# Altium project Ararinha_PCB.PrjPcb
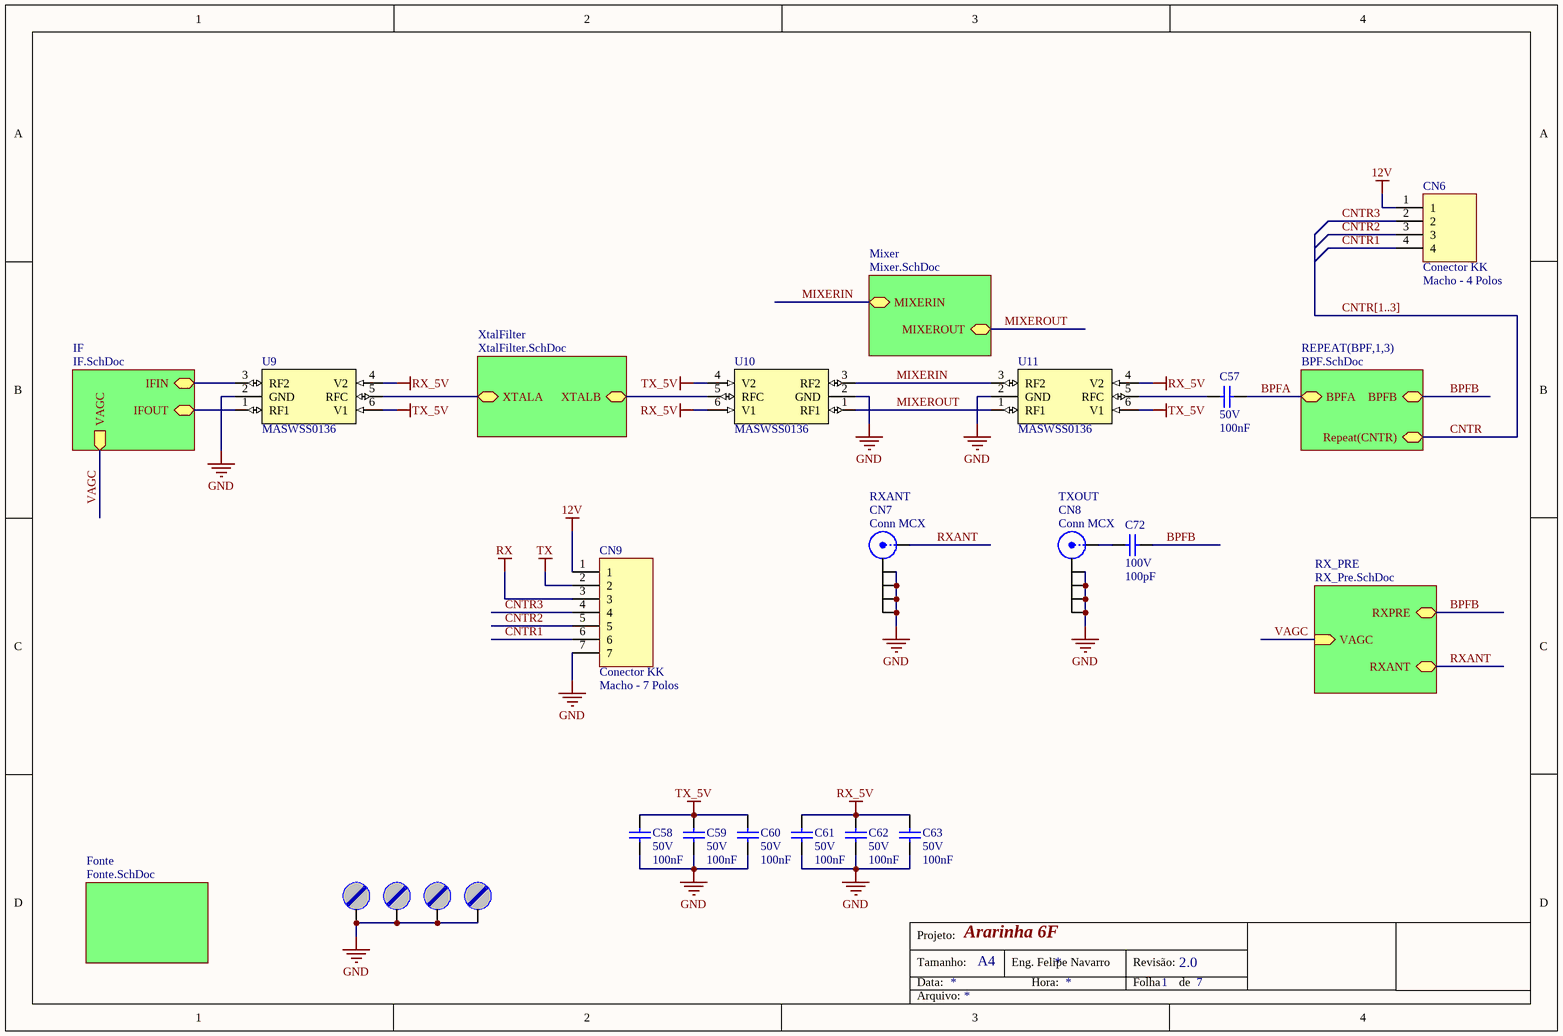
[diagram p0: Block.SchDoc]
7 sheets, 218 parts. Net scope: hierarchical (ports join the sheet entries above them; power ports are global).
Board file: Ararinha_PCB.PcbDoc
Sheets:
  Block.SchDoc
    Mixer = Mixer.SchDoc
    BPF1 = BPF.SchDoc
    BPF2 = BPF.SchDoc
    BPF3 = BPF.SchDoc
    XtalFilter = XtalFilter.SchDoc
    IF = IF.SchDoc
    RX_PRE = RX_Pre.SchDoc
    Fonte = Fonte.SchDoc

## Sheet Block.SchDoc: Ararinha 6F
size A4; Revision: 2.0; SheetNumber: 1; SheetTotal: 7

### Parts
C57  value 100nF  Tensão: 50V  [CC0603]  (hidden comment: Capacitor Cerâmico)
C58  value 100nF  Tensão: 50V  [CC0603]  (hidden comment: Capacitor Cerâmico)
C59  value 100nF  Tensão: 50V  [CC0603]  (hidden comment: Capacitor Cerâmico)
C60  value 100nF  Tensão: 50V  [CC0603]  (hidden comment: Capacitor Cerâmico)
C61  value 100nF  Tensão: 50V  [CC0603]  (hidden comment: Capacitor Cerâmico)
C62  value 100nF  Tensão: 50V  [CC0603]  (hidden comment: Capacitor Cerâmico)
C63  value 100nF  Tensão: 50V  [CC0603]  (hidden comment: Capacitor Cerâmico)
C72  value 100pF  Tensão: 100V  [CC0603]  (hidden comment: Capacitor Cerâmico)
CN6  Conector KK  value Macho - 4 Polos  [CONN HDR4-POL P.100]
CN7  Conn MCX  [CONN MCX MOLEX]
CN8  Conn MCX  [CONN MCX MOLEX]
CN9  Conector KK  value Macho - 7 Polos  [CONN HDR7-POL P.100]
HOLE1  Furo de Fixação  [Furo_M3]  (value not drawn)  (no BOM)
HOLE2  Furo de Fixação  [Furo_M3]  (value not drawn)  (no BOM)
HOLE3  Furo de Fixação  [Furo_M3]  (value not drawn)  (no BOM)
HOLE4  Furo de Fixação  [Furo_M3]  (value not drawn)  (no BOM)
U9  MASWSS0136  [SC70-6N]
U10  MASWSS0136  [SC70-6N]
U11  MASWSS0136  [SC70-6N]

### Sub-sheets
Fonte = Fonte.SchDoc: no entries
IF = IF.SchDoc: IFIN (bidir), IFOUT (bidir), VAGC (out)
Mixer = Mixer.SchDoc: MIXERIN (bidir), MIXEROUT (bidir)
REPEAT(BPF,1,3) = BPF.SchDoc: BPFA, BPFB, Repeat(CNTR)
RX_PRE = RX_Pre.SchDoc: VAGC (in), RXPRE (bidir), RXANT (bidir)
XtalFilter = XtalFilter.SchDoc: XTALB (bidir), XTALA (bidir)

### Nets
12V: CN6.1 CN9.1
GND: C58.1 C59.1 C60.1 C61.1 C62.1 C63.1 CN7.2(Y) CN7.3(Y) CN7.4(Y) CN7.5(Y) CN8.2(Y) CN8.3(Y) CN8.4(Y) CN8.5(Y) CN9.7 HOLE1.X HOLE2.X HOLE3.X HOLE4.X U9.2(GND) U10.2(GND) U11.2(GND)
RX: CN9.3
RX_5V: C61.2 C62.2 C63.2 U9.4(V2) U10.6(V1) U11.4(V2)
TX: CN9.2
TX_5V: C58.2 C59.2 C60.2 U9.6(V1) U10.4(V2) U11.6(V1)
BPFA: C57.2 ; sheet REPEAT(BPF,1,3)/BPFA
BPFB: C72.2 ; sheet REPEAT(BPF,1,3)/BPFB, sheet RX_PRE/RXPRE
CNTR: sheet REPEAT(BPF,1,3)/Repeat(CNTR)
CNTR1: CN6.4 CN9.6  [project net CNTR]
CNTR2: CN6.3 CN9.5  [project net CNTR]
CNTR3: CN6.2 CN9.4  [project net CNTR]
IFIN: U9.3(RF2) ; sheet IF/IFIN
IFOUT: U9.1(RF1) ; sheet IF/IFOUT
MIXERIN: U10.3(RF2) U11.3(RF2) ; sheet Mixer/MIXERIN
MIXEROUT: U10.1(RF1) U11.1(RF1) ; sheet Mixer/MIXEROUT
RXANT: CN7.1(X) ; sheet RX_PRE/RXANT
VAGC: sheet IF/VAGC, sheet RX_PRE/VAGC
XTALA: U9.5(RFC) ; sheet XtalFilter/XTALA
XTALB: U10.5(RFC) ; sheet XtalFilter/XTALB
NetC57_1: C57.1 U11.5(RFC)
NetC72_1: C72.1 CN8.1(X)

### Buses and harness runs
bus CNTR[1..3]

### Notes on the sheet
- (near CN7) RXANT
- TXOUT
- Projeto:
- Tamanho:
- Data:
- A4
- Eng. Felipe Navarro
- Hora:
- Revisão:
- Folha
- de
- Arquivo:

### Library data of the parts
C57-C63 = Cap 100nF 50V 0603 X7R: Capacitor (Semiconductor SIM Model); Chinês: Local; ChinesePrice: 0,00250; Corrente: *A; Potência: *W; Obs:: X7R; Tolerância: ±10%; Supplier 1: Digi-Key; Supplier Part Number 1: 1276-1000-1-ND; ComponentLink1Description: Datasheet; ComponentLink1URL: D:\Tecnoclade\Datasheet\!DataMissing.pdf
C72 = Cap 100pF 100V 0603 NP0: Capacitor (Semiconductor SIM Model); Chinês: -----; ChinesePrice: 0,00000; Corrente: *A; Potência: *W; Obs:: NP0; Tolerância: ±5%; Supplier 1: Digi-Key; Supplier Part Number 1: 1276-1295-1-ND; ComponentLink1Description: Datasheet; ComponentLink1URL: D:\Tecnoclade\Datasheet\!DataMissing.pdf
CN6 = KK 4P Macho-V P2.54mm: ChinesePrice: 0,00000; Chinês: ----; Corrente: *; Potência: *; Supplier 1: Digi-Key; Supplier Part Number 1: A19431-ND; Tensão: *; Obs:: *; Tolerância: *; ComponentLink1Description: Datasheet; ComponentLink1URL: D:\Tecnoclade\Datasheet\!DataMissing.pdf
CN7 CN8 = Conn MCX: Conector MCX; ChinesePrice: 0,00000; Chinês: ----; Value: SMA; Corrente: *; Potência: *; Supplier 1: Digi-Key; Supplier Part Number 1: WM5541-ND; Tensão: *; Obs:: *; Tolerância: *; ComponentLink1Description: Datasheet; ComponentLink1URL: D:\Tecnoclade\Datasheet\!DataMissing.pdf
CN9 = KK 7P Macho-V P2.54mm: ChinesePrice: 0,00000; Chinês: ----; Corrente: *; Potência: *; Supplier 1: Digi-Key; Supplier Part Number 1: A19472-ND; Tensão: *; Obs:: *; Tolerância: *; ComponentLink1Description: Datasheet; ComponentLink1URL: D:\Tecnoclade\Datasheet\!DataMissing.pdf
HOLE1-HOLE4 = Parafuso: Furo para parafuso; Value: M3; ChinesePrice: 0,00000; Chinês: ----; Corrente: *; Potência: *; Supplier 1: Digi-Key; Supplier Part Number 1: --Del; Tensão: *; Obs:: *; Tolerância: *; ComponentLink1Description: Datasheet; ComponentLink1URL: D:\Tecnoclade\Datasheet\!DataMissing.pdf
U9-U11 = MASWSS0136: GaAs SPDT Switch DC - 3.0 GHz; ChinesePrice: 1,94000; Chinês: Local; Value: Memória; Corrente: *; Potência: *; Supplier 1: Digi-Key; Supplier Part Number 1: 1465-1376-1-ND; Tensão: *; Obs:: *; Tolerância: *; ComponentLink1Description: Datasheet; ComponentLink1URL: D:\Tecnoclade\Datasheet\!DataMissing.pdf

## Sheet Mixer.SchDoc: Ararinha 6F
size A4; Revision: 1.0; SheetNumber: 3; SheetTotal: 7
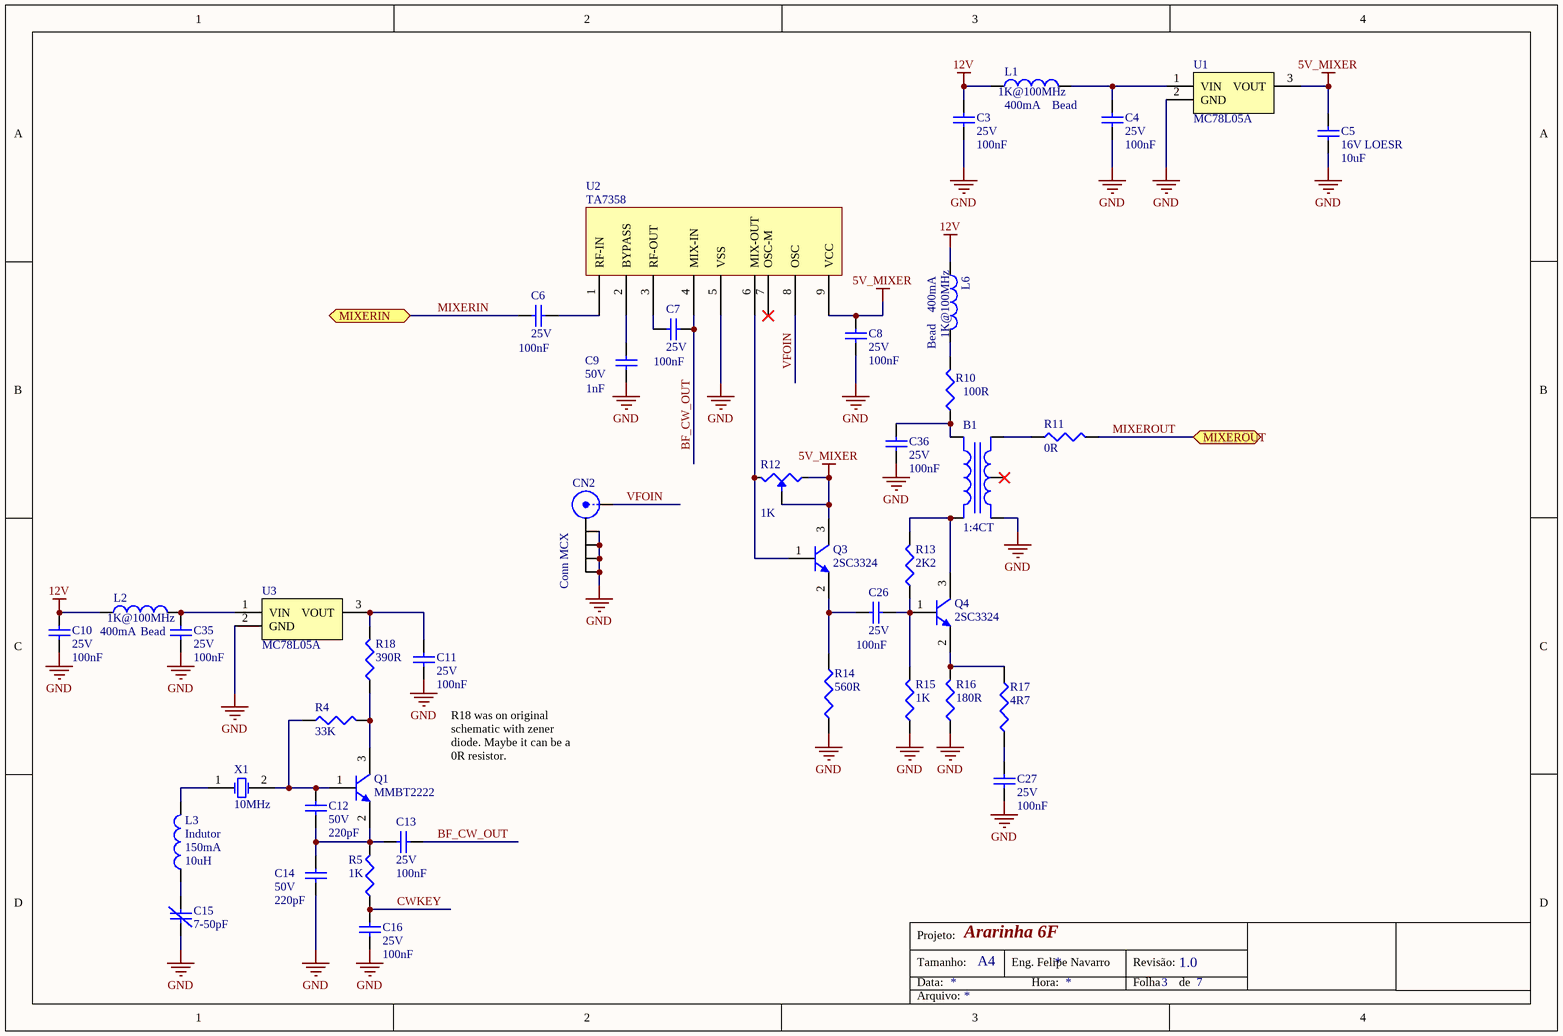
[diagram p1: Mixer.SchDoc]

### Parts
B1  1:4CT  [CX2047LANL]
C3  value 100nF  Tensão: 25V  [CC0603]  (hidden comment: Capacitor Cerâmico)
C4  value 100nF  Tensão: 25V  [CC0603]  (hidden comment: Capacitor Cerâmico)
C5  value 10uF  Tensão: 16V LOESR  [CC0805]  (hidden comment: Capacitor Cerâmico)
C6  value 100nF  Tensão: 25V  [CC0603]  (hidden comment: Capacitor Cerâmico)
C7  value 100nF  Tensão: 25V  [CC0603]  (hidden comment: Capacitor Cerâmico)
C8  value 100nF  Tensão: 25V  [CC0603]  (hidden comment: Capacitor Cerâmico)
C9  value 1nF  Tensão: 50V  [CC0603]  (hidden comment: Capacitor Cerâmico)
C10  value 100nF  Tensão: 25V  [CC0603]  (hidden comment: Capacitor Cerâmico)
C11  value 100nF  Tensão: 25V  [CC0603]  (hidden comment: Capacitor Cerâmico)
C12  value 220pF  Tensão: 50V  [CC0603]  (hidden comment: Capacitor Cerâmico)
C13  value 100nF  Tensão: 25V  [CC0603]  (hidden comment: Capacitor Cerâmico)
C14  value 220pF  Tensão: 50V  [CC0603]  (hidden comment: Capacitor Cerâmico)
C15  value 7-50pF  [MURATA TZB4]  (hidden comment: Trimmer)
C16  value 100nF  Tensão: 25V  [CC0603]  (hidden comment: Capacitor Cerâmico)
C26  value 100nF  Tensão: 25V  [CC0603]  (hidden comment: Capacitor Cerâmico)
C27  value 100nF  Tensão: 25V  [CC0603]  (hidden comment: Capacitor Cerâmico)
C35  value 100nF  Tensão: 25V  [CC0603]  (hidden comment: Capacitor Cerâmico)
C36  value 100nF  Tensão: 25V  [CC0603]  (hidden comment: Capacitor Cerâmico)
CN2  Conn MCX  [CONN MCX MOLEX]
L1  Bead  value 1K@100MHz  Corrente: 400mA  [CC0603]
L2  Bead  value 1K@100MHz  Corrente: 400mA  [CC0603]
L3  Indutor  value 10uH  Corrente: 150mA  [CC0805]
L6  Bead  value 1K@100MHz  Corrente: 400mA  [CC0603]
Q1  MMBT2222  [SOT-23-3N]
Q3  2SC3324  [SOT-23-3N]
Q4  2SC3324  [SOT-23-3N]
R4  value 33K  [CC0603]  (hidden comment: Resistor)
R5  value 1K  [CC0603]  (hidden comment: Resistor)
R10  value 100R  [CC0805]  (hidden comment: Resistor)
R11  value 0R  [CC0603~0805]  (hidden comment: Resistor)
R12  value 1K  [POT]  (hidden comment: Potenciômetro)
R13  value 2K2  [CC0603]  (hidden comment: Resistor)
R14  value 560R  [CC0603]  (hidden comment: Resistor)
R15  value 1K  [CC0603]  (hidden comment: Resistor)
R16  value 180R  [CC0603]  (hidden comment: Resistor)
R17  value 4R7  [CC0603]  (hidden comment: Resistor)
R18  value 390R  [CC0603]  (hidden comment: Resistor)
U1  MC78L05A  [SOT-89-3N]
U2  TA7358  [SIP9]
U3  MC78L05A  [SOT-89-3N]
X1  10MHz  [HC/49US]

### Ports
MIXERIN (bidir), MIXEROUT (bidir)

### Nets
5V_MIXER: C5.2 C8.1 Q3.3(C) R12.1 R12.2(TAP) U1.3(VOUT) U2.9(VCC)
12V: C3.1 C10.2 L1.1 L2.1 L6.1
GND: B1.3(Pri-) C3.2 C4.2 C5.1 C8.2 C9.2 C10.1 C11.1 C14.1 C15.1 C16.1 C27.2 C35.1 C36.2 CN2.2(Y) CN2.3(Y) CN2.4(Y) CN2.5(Y) R14.1 R15.1 R16.1 U1.2(GND) U2.5(VSS) U3.2(GND)
BF_CW_OUT: C7.1 C13.2 U2.4(MIX-IN)
CWKEY: C16.2 R5.1
MIXERIN: C6.2 ; port MIXERIN
MIXEROUT: R11.2 ; port MIXEROUT
VFOIN: CN2.1(X) U2.8(OSC)
NetB1_1: B1.1(Sec+) R11.1
NetB1_4: B1.4(Pri+) Q4.3(C) R13.2
NetB1_6: B1.6(Sec-) C36.1 R10.1
NetC4_1: C4.1 L1.2 U1.1(VIN)
NetC6_1: C6.1 U2.1(RF-IN)
NetC7_2: C7.2 U2.3(RF-OUT)
NetC9_1: C9.1 U2.2(BYPASS)
NetC11_2: C11.2 R18.2 U3.3(VOUT)
NetC12_1: C12.1 C13.1 C14.2 Q1.2(E) R5.2
NetC12_2: C12.2 Q1.1(B) R4.1 X1.2(OSC2)
NetC15_2: C15.2 L3.1
NetC26_1: C26.1 Q4.1(B) R13.1 R15.2
NetC26_2: C26.2 Q3.2(E) R14.2
NetC27_1: C27.1 R17.1
NetC35_2: C35.2 L2.2 U3.1(VIN)
NetL3_2: L3.2 X1.1(OSC1)
NetL6_2: L6.2 R10.2
NetQ1_3: Q1.3(C) R4.2 R18.1
NetQ3_1: Q3.1(B) R12.3 U2.6(MIX-OUT)
NetQ4_2: Q4.2(E) R16.2 R17.2

Not connected (* = marked no-connect by the designer): B1 2(Sec+)*; U2 7(OSC-M)*

### Notes on the sheet
- (near C11) R18 was on original schematic with zener diode. Maybe it can be a 0R resistor.
- Projeto:
- Tamanho:
- Data:
- A4
- Eng. Felipe Navarro
- Hora:
- Revisão:
- Folha
- de
- Arquivo:

### Library data of the parts
B1 = BALUN CX2047LANL: Balun 4CT:1; ChinesePrice: 0,00000; Chinês: ----; Corrente: *; Potência: *; Supplier 1: Digi-Key; Supplier Part Number 1: 553-2770-1-ND; Tensão: *; Obs:: *; Tolerância: *; ComponentLink1Description: Datasheet; ComponentLink1URL: D:\Tecnoclade\Datasheet\!DataMissing.pdf; Substituição: 00/00/0000; Value: *
C3 C4 C6-C8 C10 C11 C16 C26 C27 C35 C36 = Cap 100nF 25V 0603 X7R: Capacitor (Semiconductor SIM Model); Chinês: Local; ChinesePrice: 0,00246; Corrente: *A; Potência: *W; Obs:: X7R; Tolerância: ±10%; Supplier 1: Digi-Key; Supplier Part Number 1: 490-1524-1-ND; ComponentLink1Description: Datasheet; ComponentLink1URL: D:\Tecnoclade\Datasheet\!DataMissing.pdf
C5 = Cap 10uF 16V 0805 X6S LOESR: Capacitor (Semiconductor SIM Model); Chinês: -----; ChinesePrice: 0,00000; Corrente: *A; Potência: *W; Obs:: X6S - C2012X6S1C106K; Tolerância: ±10%; Supplier 1: Digi-Key; Supplier Part Number 1: 445-7611-1-ND; ComponentLink1Description: Datasheet; ComponentLink1URL: D:\Tecnoclade\Datasheet\!DataMissing.pdf
C9 = Cap 1nF 50V 0603 NP0: Capacitor (Semiconductor SIM Model); Chinês: Local; ChinesePrice: 0,00700; Corrente: *A; Potência: *W; Obs:: NP0; Tolerância: ±5%; Supplier 1: Digi-Key; Supplier Part Number 1: 490-1451-1-ND; ComponentLink1Description: Datasheet; ComponentLink1URL: D:\Tecnoclade\Datasheet\!DataMissing.pdf
C12 C14 = Cap 220pF 50V 0603 NP0: Capacitor (Semiconductor SIM Model); Chinês: -----; ChinesePrice: 0,00000; Corrente: *A; Potência: *W; Obs:: NP0; Tolerância: ±5%; Supplier 1: Digi-Key; Supplier Part Number 1: 1276-1048-1-ND; ComponentLink1Description: Datasheet; ComponentLink1URL: D:\Tecnoclade\Datasheet\!DataMissing.pdf
C13 = Cap 2.2pf 50V 0603 C0G: Capacitor (Semiconductor SIM Model); Chinês: ----; ChinesePrice: 0,00000; Corrente: *A; Potência: *W; Tolerância: ±*%; Supplier 1: Digi-Key; Supplier Part Number 1: 490-3091-1-ND; Obs:: *; ComponentLink1Description: Datasheet; ComponentLink1URL: D:\Tecnoclade\Datasheet\!DataMissing.pdf
C15 = Trimmer 7-50pF 50V TZB4-BB: Capacitor (Semiconductor SIM Model); Chinês: ----; ChinesePrice: 0,00000; Corrente: *A; Potência: *W; Tolerância: ±*%; Tensão: 50V; Supplier 1: Digi-Key; Supplier Part Number 1: 490-1983-1-ND; Obs:: *; ComponentLink1Description: Datasheet; ComponentLink1URL: D:\Tecnoclade\Datasheet\!DataMissing.pdf
CN2 = Conn MCX: as CN7 on sheet Block; Corrente: *; Potência: *; Supplier 1: Digi-Key; Supplier Part Number 1: WM5541-ND; Tensão: *; Obs:: *; Tolerância: *; ComponentLink1Description: Datasheet; ComponentLink1URL: D:\Tecnoclade\Datasheet\!DataMissing.pdf
L1 L2 L6 = Bd 1K@100MHz 0603 400mA: ChinesePrice: 0,00000; Chinês: -----; Obs:: Ferrite (0R5); Tolerância: ±25%; Potência: *; Supplier 1: Digi-Key; Supplier Part Number 1: 445-1550-1-ND; Tensão: *; ComponentLink1Description: Datasheet; ComponentLink1URL: D:\Tecnoclade\Datasheet\!DataMissing.pdf; Substituição: 27/06/2014
L3 = Ind 10uH 0805 150mA: Inductor; ChinesePrice: 0,00000; Chinês: ----; Tolerância: ±10%; Potência: *; Supplier 1: Digi-Key; Supplier Part Number 1: 587-2045-1-ND; Tensão: *; Obs:: *; ComponentLink1Description: Datasheet; ComponentLink1URL: D:\Tecnoclade\Datasheet\!DataMissing.pdf; Substituição: 00/00/0000
Q1 = TRS MMBT2222 40V 200mA SOT-23-3N: NPN General Purpose Amplifier; Tensão: 40V; Corrente: 200mA; Potência: 250mW; Chinês: ----; ChinesePrice: 0,00000; Value: 300MHz; Supplier 1: Digi-Key; Supplier Part Number 1: MMBT2222ATPMSCT-ND; Obs:: *; Tolerância: *; ComponentLink1Description: Datasheet; ComponentLink1URL: D:\Tecnoclade\Datasheet\!DataMissing.pdf
Q3 Q4 = TRS 2SC3324 120V 100mA SOT-23-3: NPN General Purpose Amplifier; Tensão: 40V; Corrente: 600mA; Potência: 350mW; Chinês: ----; ChinesePrice: 0,00000; Value: 300MHz; Supplier 1: Digi-Key; Supplier Part Number 1: 2SC3324-BL(TE85LFCT-ND; Obs:: *; Tolerância: *; ComponentLink1Description: Datasheet; ComponentLink1URL: D:\Tecnoclade\Datasheet\!DataMissing.pdf
R4 = Res 33K 1% 0603 1/10W: ChinesePrice: 0,00000; Chinês: ----; Corrente: *A; Potência: 1/10W; Tensão: *V; Obs: ±100ppm/ºC; Tolerância: ±1%; Supplier 1: Digi-Key; Supplier Part Number 1: RMCF0603FT33K0CT-ND; ComponentLink1Description: Datasheet; ComponentLink1URL: D:\Tecnoclade\Datasheet\!DataMissing.pdf
R5 R15 = Res 1K 1% 0603 1/10W: ChinesePrice: 0,00089; Chinês: Local; Corrente: *A; Potência: 1/10W; Tensão: *V; Tolerância: ±1%; Supplier 1: Digi-Key; Supplier Part Number 1: RMCF0603FT1K00CT-ND; Obs: *; ComponentLink1Description: Datasheet; ComponentLink1URL: D:\Tecnoclade\Datasheet\!DataMissing.pdf
R10 = Res 100R 5% 0805 1/8W: ChinesePrice: 0,00150; Chinês: Local; Corrente: *A; Potência: 1/8W; Tensão: *V; Obs: ±200ppm/ºC; Tolerância: ±5%; Supplier 1: Digi-Key; Supplier Part Number 1: RMCF0805JT100RCT-ND; ComponentLink1Description: Datasheet; ComponentLink1URL: D:\Tecnoclade\Datasheet\!DataMissing.pdf
R11 = Res 0R 0603 1/10W: ChinesePrice: 0,00089; Chinês: Local; Corrente: *A; Potência: 1/10W; Tensão: *V; Tolerância: Jumper; Supplier 1: Digi-Key; Supplier Part Number 1: P0.0GCT-ND; Obs: *; ComponentLink1Description: Datasheet; ComponentLink1URL: D:\Tecnoclade\Datasheet\!DataMissing.pdf
R12 = Res Pot: Potenciometro; ChinesePrice: 0,00000; Chinês: ----; Corrente: *A; Potência: *W; Tensão: *V; Tolerância: ±*%; Supplier 1: Digi-Key; Supplier Part Number 1: --Del; Obs: *; ComponentLink1Description: Datasheet; ComponentLink1URL: D:\Tecnoclade\Datasheet\!DataMissing.pdf
R13 = Res 2K2 5% 0603 1/10W: ChinesePrice: 0,00000; Chinês: ----; Corrente: *A; Potência: 1/10W; Tensão: *V; Obs: ±200ºC/ppm; Tolerância: ±5%; Supplier 1: Digi-Key; Supplier Part Number 1: RMCF0603JT2K20CT-ND; ComponentLink1Description: Datasheet; ComponentLink1URL: D:\Tecnoclade\Datasheet\!DataMissing.pdf
R14 = Res 560R 1% 0603 1/10w: ChinesePrice: 0,00000; Chinês: ----; Corrente: *A; Potência: 1/10W; Tensão: *V; Tolerância: ±*%; Supplier 1: Digi-Key; Supplier Part Number 1: 311-560HRCT-ND; Obs:: *; ComponentLink1Description: Datasheet; ComponentLink1URL: D:\Tecnoclade\Datasheet\!DataMissing.pdf
R16 = Res 180R 1% 0603 1/10W: ChinesePrice: 0,00000; Chinês: -----; Corrente: *A; Potência: 1/10W; Tensão: *V; Obs: ±100ppm/ºC; Tolerância: ±1%; Supplier 1: Digi-Key; Supplier Part Number 1: RMCF0603FT180RCT-ND; ComponentLink1Description: Datasheet; ComponentLink1URL: D:\Tecnoclade\Datasheet\!DataMissing.pdf
R17 = Res 4R7 1% 0603 1/10W: ChinesePrice: 0,00000; Chinês: ----; Corrente: *A; Potência: 1/10W; Tensão: *V; Tolerância: ±*%; Supplier 1: Digi-Key; Supplier Part Number 1: 311-4.7GRCT-ND; Obs:: *; ComponentLink1Description: Datasheet; ComponentLink1URL: D:\Tecnoclade\Datasheet\!DataMissing.pdf
R18 = Res 390R 1% 0603 1/10W: ChinesePrice: 0,00000; Chinês: ----; Corrente: *A; Potência: 1/10W; Tensão: *V; Obs: ±100ppm/ºC; Tolerância: ±1%; Supplier 1: Digi-Key; Supplier Part Number 1: RMCF0603FT390RCT-ND; ComponentLink1Description: Datasheet; ComponentLink1URL: D:\Tecnoclade\Datasheet\!DataMissing.pdf
U1 U3 = MC78L05: Regulador Linear 5V; Chinês: -----; Corrente: 100mA; ChinesePrice: 0,00000; Potência: *; Value: *; Supplier 1: Digi-Key; Supplier Part Number 1: MC78L05ACHXCT-ND; Tensão: 5V; Obs:: *; Tolerância: *; ComponentLink1Description: Datasheet; ComponentLink1URL: D:\Tecnoclade\Datasheet\
U2 = TA7358: FM FRONT-END; ChinesePrice: 0,00000; Chinês: ----; Corrente: *; Potência: *; Tensão: *; Value: *; Supplier 1: Digi-Key; Obs:: *; Tolerância: *; ComponentLink1Description: Datasheet; ComponentLink1URL: D:\Tecnoclade\Datasheet\
X1 = XTAL: Crystal Oscillator; ChinesePrice: 0,00000; Chinês: ----; Value: 20pF/40R; Corrente: *; Potência: *; Supplier 1: Digi-Key; Supplier Part Number 1: --Del; Tensão: *; Obs:: *; Tolerância: *

## Sheet BPF.SchDoc: Ararinha 6F
size A4; Revision: 1.0; SheetNumber: 6; SheetTotal: 7
Used 3 times, as channels BPF1, BPF2, BPF3. Parts and nets are listed once, with the designators drawn on the sheet.
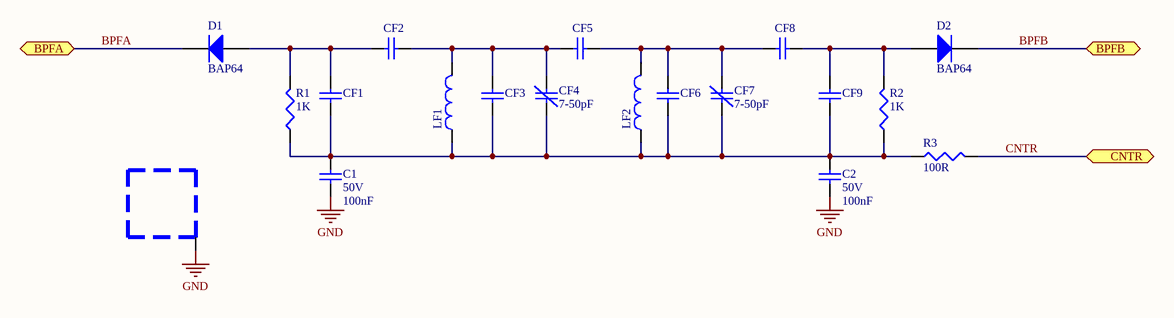
[diagram p2: BPF.SchDoc]

### Parts
BL1  Blindagem BPF  [SHIELD_26.5X26.5]  (value not drawn)
C1  value 100nF  Tensão: 50V  [CC0603]  (hidden comment: Capacitor Cerâmico)
C2  value 100nF  Tensão: 50V  [CC0603]  (hidden comment: Capacitor Cerâmico)
CF1  Capacitor Cerâmico  [CC0603]  (value not drawn)
CF2  Capacitor Cerâmico  [CC0603]  (value not drawn)
CF3  Capacitor Cerâmico  [CC0603]  (value not drawn)
CF4  value 7-50pF  [MURATA TZB4]  (hidden comment: Trimmer)
CF5  Capacitor Cerâmico  [CC0603]  (value not drawn)
CF6  Capacitor Cerâmico  [CC0603]  (value not drawn)
CF7  value 7-50pF  [MURATA TZB4]  (hidden comment: Trimmer)
CF8  Capacitor Cerâmico  [CC0603]  (value not drawn)
CF9  Capacitor Cerâmico  [CC0603]  (value not drawn)
D1  BAP64  [SOD523]
D2  BAP64  [SOD523]
LF1  Bead  [CC0603]  (value not drawn)
LF2  Bead  [CC0603]  (value not drawn)
R1  value 1K  [CC0603]  (hidden comment: Resistor)
R2  value 1K  [CC0603]  (hidden comment: Resistor)
R3  value 100R  [CC0603]  (hidden comment: Resistor)

### Ports
BPFA (bidir), BPFB (bidir), CNTR

### Nets
GND: BL1.1(GND) C1.1 C2.1
BPFA: D1.2(K) ; port BPFA
BPFB: D2.2(K) ; port BPFB
CNTR: R3.2 ; port CNTR
NetC1_2: C1.2 C2.2 CF1.1 CF3.2 CF4.1 CF6.1 CF7.1 CF9.2 LF1.1 LF2.1 R1.1 R2.1 R3.1
NetCF1_2: CF1.2 CF2.2 D1.1(A) R1.2
NetCF2_1: CF2.1 CF3.1 CF4.2 CF5.1 LF1.2
NetCF5_2: CF5.2 CF6.2 CF7.2 CF8.2 LF2.2
NetCF8_1: CF8.1 CF9.1 D2.1(A) R2.2

### Channels
BPF1: designators end in .1; ports BPFA=BPFA BPFB=BPFB CNTR=CNTR
BPF2: designators end in .2; ports BPFA=BPFA BPFB=BPFB CNTR=CNTR
BPF3: designators end in .3; ports BPFA=BPFA BPFB=BPFB CNTR=CNTR

### Notes on the sheet
- Projeto:
- Tamanho:
- Data:
- A4
- Eng. Felipe Navarro
- Hora:
- Revisão:
- Folha
- de
- Arquivo:

### Library data of the parts
BL1 = Blindagem BPF: ChinesePrice: 0,00000; Chinês: ----; Corrente: *; Potência: *; Supplier 1: Digi-Key; Supplier Part Number 1: --Del; Tensão: *; Value: *; Obs:: *; Tolerância: *; ComponentLink1Description: Datasheet; ComponentLink1URL: D:\Tecnoclade\Datasheet\
C1 C2 = Cap 100nF 50V 0603 X7R: as C57 on sheet Block; Supplier 1: Digi-Key; Supplier Part Number 1: 1276-1000-1-ND; ComponentLink1Description: Datasheet; ComponentLink1URL: D:\Tecnoclade\Datasheet\!DataMissing.pdf
CF1-CF3 CF5 CF6 CF8 CF9 = Cap - $Val $V $Footprint $Classe_1: Capacitor (Semiconductor SIM Model); Chinês: ----; ChinesePrice: 0,00000; Corrente: *A; Potência: *W; Tolerância: ±*%; Tensão: 25V; Value: 100nF; Supplier 1: Digi-Key; Supplier Part Number 1: --Del; Obs:: *; ComponentLink1Description: Datasheet; ComponentLink1URL: D:\Tecnoclade\Datasheet\!DataMissing.pdf
CF4 CF7 = Trimmer 7-50pF 50V TZB4-BB: as C15 on sheet Mixer; Supplier 1: Digi-Key; Supplier Part Number 1: 490-1983-1-ND; Obs:: *; ComponentLink1Description: Datasheet; ComponentLink1URL: D:\Tecnoclade\Datasheet\!DataMissing.pdf
D1 D2 = PIN BAP64: PIN DIODE; ChinesePrice: 0,00000; Chinês: ----; Corrente: *; Potência: *; Supplier 1: Digi-Key; Supplier Part Number 1: 568-1929-1-ND; Tensão: *; Value: *; Obs:: *; Tolerância: *; ComponentLink1Description: Datasheet; ComponentLink1URL: D:\Tecnoclade\Datasheet\!DataMissing.pdf
LF1 LF2 = Bd 1K@100MHz 0603 400mA: ChinesePrice: 0,00000; Chinês: -----; Obs:: Ferrite (0R5); Tolerância: ±25%; Corrente: 400mA; Potência: *; Supplier 1: Digi-Key; Supplier Part Number 1: 445-1550-1-ND; Tensão: *; ComponentLink1Description: Datasheet; ComponentLink1URL: D:\Tecnoclade\Datasheet\!DataMissing.pdf; Substituição: 27/06/2014; Value: 1K@100MHz
R1 R2 = Res 1K 1% 0603 1/10W: as R5 on sheet Mixer; Supplier 1: Digi-Key; Supplier Part Number 1: RMCF0603FT1K00CT-ND; Obs: *; ComponentLink1Description: Datasheet; ComponentLink1URL: D:\Tecnoclade\Datasheet\!DataMissing.pdf
R3 = Res 100R 5% 0603 1/10W: ChinesePrice: 0,00080; Chinês: Local; Corrente: *A; Potência: 1/10W; Tensão: *V; Tolerância: ±5%; Supplier 1: Digi-Key; Supplier Part Number 1: RMCF0603JT100RCT-ND; Obs: *; ComponentLink1Description: Datasheet; ComponentLink1URL: D:\Tecnoclade\Datasheet\!DataMissing.pdf

## Sheet XtalFilter.SchDoc: Ararinha 6F
size A4; Revision: 1.0; SheetNumber: 5; SheetTotal: 7
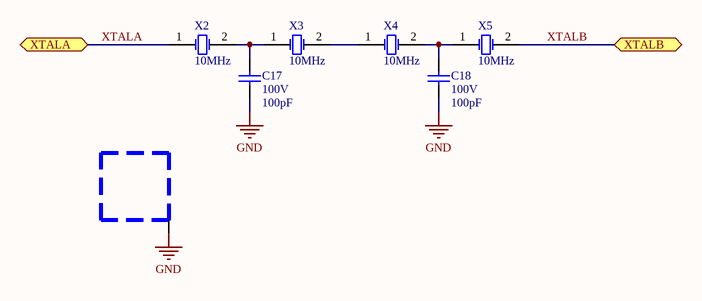
[diagram p3: XtalFilter.SchDoc]

### Parts
BL2  Blindagem BPF  [SHIELD_26.5X26.5]  (value not drawn)
C17  value 100pF  Tensão: 100V  [CC0603]  (hidden comment: Capacitor Cerâmico)
C18  value 100pF  Tensão: 100V  [CC0603]  (hidden comment: Capacitor Cerâmico)
X2  10MHz  [HC/49US]
X3  10MHz  [HC/49US]
X4  10MHz  [HC/49US]
X5  10MHz  [HC/49US]

### Ports
XTALA, XTALB (bidir)

### Nets
GND: BL2.1(GND) C17.1 C18.1
XTALA: X2.1(OSC1) ; port XTALA
XTALB: X5.2(OSC2) ; port XTALB
NetC17_2: C17.2 X2.2(OSC2) X3.1(OSC1)
NetC18_2: C18.2 X4.2(OSC2) X5.1(OSC1)
NetX3_2: X3.2(OSC2) X4.1(OSC1)

### Notes on the sheet
- Projeto:
- Tamanho:
- Data:
- A4
- Eng. Felipe Navarro
- Hora:
- Revisão:
- Folha
- de
- Arquivo:

### Library data of the parts
BL2 = Blindagem BPF: ChinesePrice: 0,00000; Chinês: ----; Corrente: *; Potência: *; Supplier 1: Digi-Key; Supplier Part Number 1: --Del; Tensão: *; Value: *; Obs:: *; Tolerância: *; ComponentLink1Description: Datasheet; ComponentLink1URL: D:\Tecnoclade\Datasheet\
C17 C18 = Cap 100pF 100V 0603 NP0: as C72 on sheet Block; Supplier 1: Digi-Key; Supplier Part Number 1: 1276-1295-1-ND; ComponentLink1Description: Datasheet; ComponentLink1URL: D:\Tecnoclade\Datasheet\!DataMissing.pdf
X2-X5 = XTAL: as X1 on sheet Mixer; Corrente: *; Potência: *; Supplier 1: Digi-Key; Supplier Part Number 1: ECS-100-18-5PX-TR; Tensão: *; Obs:: *; Tolerância: *

## Sheet IF.SchDoc: Ararinha 6F
size A4; Revision: 1.0; SheetNumber: 2; SheetTotal: 7
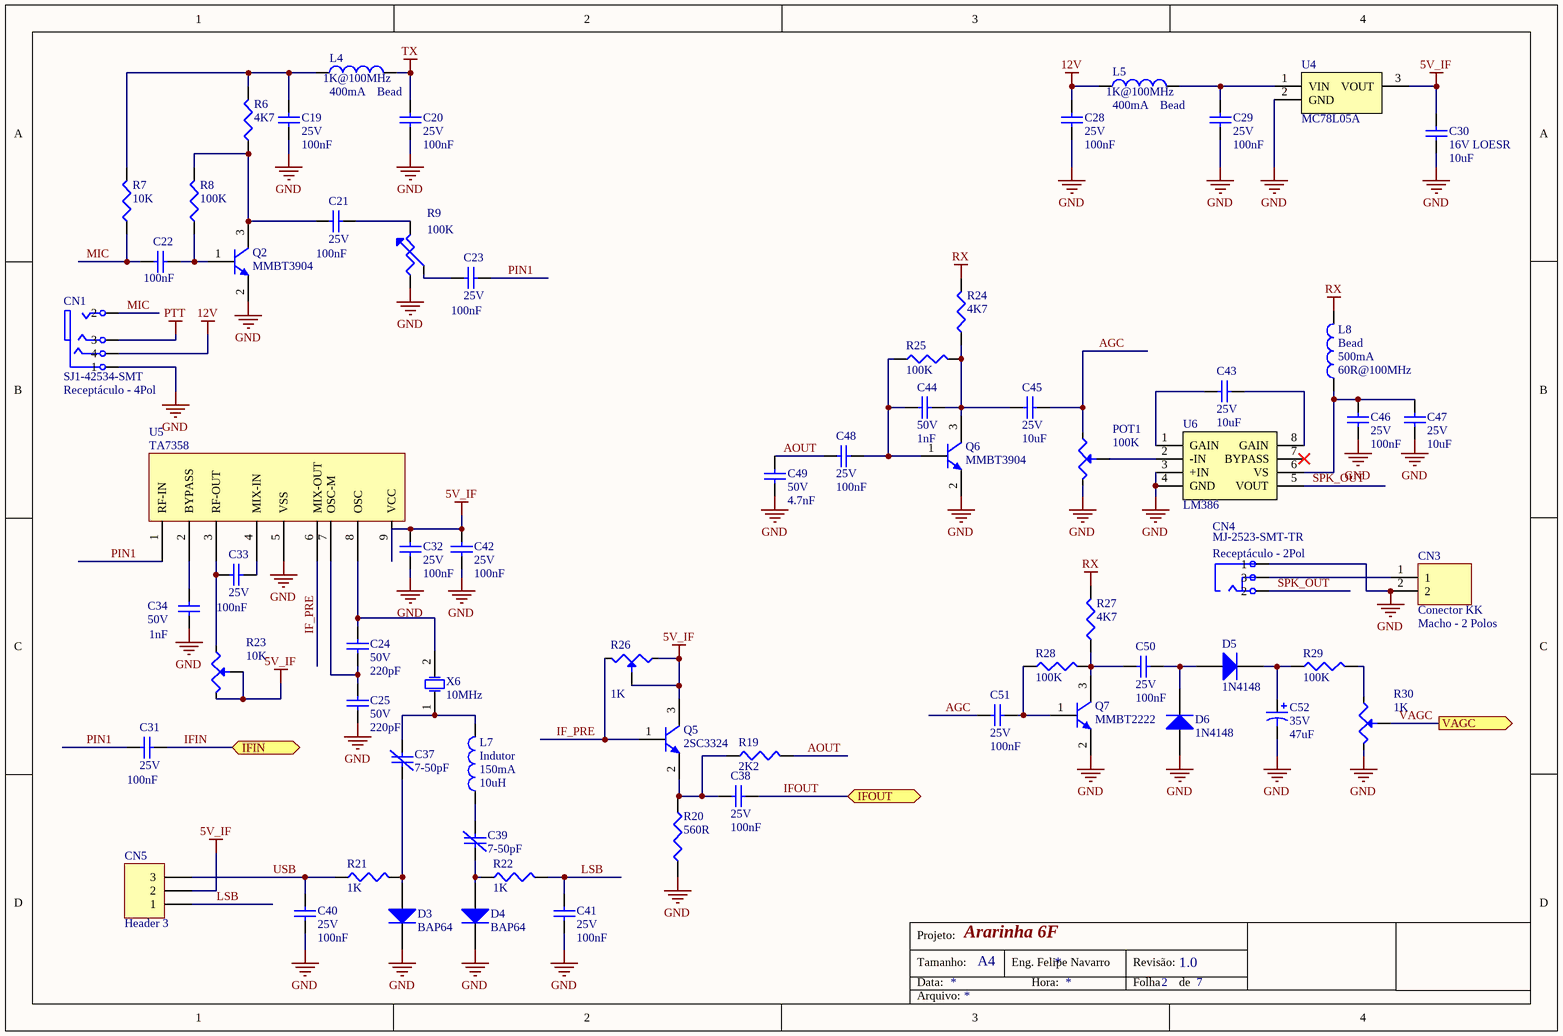
[diagram p4: IF.SchDoc]

### Parts
C19  value 100nF  Tensão: 25V  [CC0603]  (hidden comment: Capacitor Cerâmico)
C20  value 100nF  Tensão: 25V  [CC0603]  (hidden comment: Capacitor Cerâmico)
C21  value 100nF  Tensão: 25V  [CC0603]  (hidden comment: Capacitor Cerâmico)
C22  value 100nF  [CC0603]  (hidden comment: Capacitor Cerâmico)
C23  value 100nF  Tensão: 25V  [CC0603]  (hidden comment: Capacitor Cerâmico)
C24  value 220pF  Tensão: 50V  [CC0603]  (hidden comment: Capacitor Cerâmico)
C25  value 220pF  Tensão: 50V  [CC0603]  (hidden comment: Capacitor Cerâmico)
C28  value 100nF  Tensão: 25V  [CC0603]  (hidden comment: Capacitor Cerâmico)
C29  value 100nF  Tensão: 25V  [CC0603]  (hidden comment: Capacitor Cerâmico)
C30  value 10uF  Tensão: 16V LOESR  [CC0805]  (hidden comment: Capacitor Cerâmico)
C31  value 100nF  Tensão: 25V  [CC0603]  (hidden comment: Capacitor Cerâmico)
C32  value 100nF  Tensão: 25V  [CC0603]  (hidden comment: Capacitor Cerâmico)
C33  value 100nF  Tensão: 25V  [CC0603]  (hidden comment: Capacitor Cerâmico)
C34  value 1nF  Tensão: 50V  [CC0603]  (hidden comment: Capacitor Cerâmico)
C37  value 7-50pF  [MURATA TZB4]  (hidden comment: Trimmer)
C38  value 100nF  Tensão: 25V  [CC0603]  (hidden comment: Capacitor Cerâmico)
C39  value 7-50pF  [MURATA TZB4]  (hidden comment: Trimmer)
C40  value 100nF  Tensão: 25V  [CC0603]  (hidden comment: Capacitor Cerâmico)
C41  value 100nF  Tensão: 25V  [CC0603]  (hidden comment: Capacitor Cerâmico)
C42  value 100nF  Tensão: 25V  [CC0603]  (hidden comment: Capacitor Cerâmico)
C43  value 10uF  Tensão: 25V  [CC0805]  (hidden comment: Capacitor Cerâmico)
C44  value 1nF  Tensão: 50V  [CC0603]  (hidden comment: Capacitor Cerâmico)
C45  value 10uF  Tensão: 25V  [CC0805]  (hidden comment: Capacitor Cerâmico)
C46  value 100nF  Tensão: 25V  [CC0603]  (hidden comment: Capacitor Cerâmico)
C47  value 10uF  Tensão: 25V  [CC0805]  (hidden comment: Capacitor Cerâmico)
C48  value 100nF  Tensão: 25V  [CC0603]  (hidden comment: Capacitor Cerâmico)
C49  value 4.7nF  Tensão: 50V  [CC0603]  (hidden comment: Capacitor Cerâmico)
C50  value 100nF  Tensão: 25V  [CC0603]  (hidden comment: Capacitor Cerâmico)
C51  value 100nF  Tensão: 25V  [CC0603]  (hidden comment: Capacitor Cerâmico)
C52  value 47uF  Tensão: 35V  [CPOLRAD5X11]  (hidden comment: Capacitor Eletrolítico)
CN1  SJ1-42534-SMT  value Receptáculo - 4Pol  [CONN_JACK-P2_2.5-4N]
CN3  Conector KK  value Macho - 2 Polos  [CONN HDR2-POL P.100]
CN4  MJ-2523-SMT-TR  value Receptáculo - 2Pol  [MJ-2523-SMT-TR]
CN5  Header 3  [CONN HDR1X3]
D3  BAP64  [SOD523]
D4  BAP64  [SOD523]
D5  1N4148  [SOD-323 Diodo-K2]
D6  1N4148  [SOD-323 Diodo-K2]
L4  Bead  value 1K@100MHz  Corrente: 400mA  [CC0603]
L5  Bead  value 1K@100MHz  Corrente: 400mA  [CC0603]
L7  Indutor  value 10uH  Corrente: 150mA  [CC0805]
L8  Bead  value 60R@100MHz  Corrente: 500mA  [CC0603]
POT1  value 100K  [POT - PTV09]  (hidden comment: Potenciômetro)
Q2  MMBT3904  [SOT-23-3N]
Q5  2SC3324  [SOT-23-3N]
Q6  MMBT3904  [SOT-23-3N]
Q7  MMBT2222  [SOT-23-3N]
R6  value 4K7  [CC0603]  (hidden comment: Resistor)
R7  value 10K  [CC0603]  (hidden comment: Resistor)
R8  value 100K  [CC0603]  (hidden comment: Resistor)
R9  value 100K  [POT]  (hidden comment: Potenciômetro)
R19  value 2K2  [CC0603]  (hidden comment: Resistor)
R20  value 560R  [CC0603]  (hidden comment: Resistor)
R21  value 1K  [CC0603]  (hidden comment: Resistor)
R22  value 1K  [CC0603]  (hidden comment: Resistor)
R23  value 10K  [POT]  (hidden comment: Potenciômetro)
R24  value 4K7  [CC0603]  (hidden comment: Resistor)
R25  value 100K  [CC0603]  (hidden comment: Resistor)
R26  value 1K  [POT]  (hidden comment: Potenciômetro)
R27  value 4K7  [CC0603]  (hidden comment: Resistor)
R28  value 100K  [CC0603]  (hidden comment: Resistor)
R29  value 100K  [CC0603]  (hidden comment: Resistor)
R30  value 1K  [POT]  (hidden comment: Potenciômetro)
U4  MC78L05A  [SOT-89-3N]
U5  TA7358  [SIP9]
U6  LM386  [SOIC-8N]
X6  10MHz  [HC/49US]

### Ports
IFIN (bidir), IFOUT (bidir), VAGC (out)

### Nets
5V_IF: C30.2 C32.1 C42.1 CN5.2 Q5.3(C) R23.2(TAP) R23.3 R26.1 R26.2(TAP) U4.3(VOUT) U5.9(VCC)
12V: C28.1 CN1.4 L5.1
GND: C19.2 C20.2 C25.1 C28.2 C29.2 C30.1 C32.2 C34.2 C40.2 C41.2 C42.2 C46.2 C47.1 C49.1 C52.2 CN1.1 CN3.2 CN4.1 D3.2(K) D4.2(K) D6.1(A) POT1.3 Q2.2(E) Q6.2(E) Q7.2(E) R9.2 R20.1 R30.3 U4.2(GND) U5.5(VSS) U6.3(+IN) U6.4(GND)
PTT: CN1.3
RX: L8.2 R24.2 R27.2
TX: C20.1 L4.2
AGC: C45.2 C51.1 POT1.1
AOUT: C48.1 C49.2 R19.2
IF_PRE: Q5.1(B) R26.3 U5.6(MIX-OUT)
IFIN: C31.1 ; port IFIN
IFOUT: C38.2 ; port IFOUT
LSB: C41.1 CN5.1 R22.2
MIC: C22.2 CN1.2 R7.1
PIN1: C23.1 C31.2 U5.1(RF-IN)
SPK_OUT: CN4.2 U6.5(VOUT)
USB: C40.1 CN5.3 R21.1
VAGC: R30.2(TAP) ; port VAGC
NetC19_1: C19.1 L4.1 R6.2 R7.2
NetC21_1: C21.1 R9.1
NetC21_2: C21.2 Q2.3(C) R6.1 R8.2
NetC22_1: C22.1 Q2.1(B) R8.1
NetC23_2: C23.2 R9.3(TAP)
NetC24_1: C24.1 C25.2 U5.7(OSC-M)
NetC24_2: C24.2 U5.8(OSC) X6.2(OSC2)
NetC29_1: C29.1 L5.2 U4.1(VIN)
NetC33_1: C33.1 U5.4(MIX-IN)
NetC33_2: C33.2 R23.1 U5.3(RF-OUT)
NetC34_1: C34.1 U5.2(BYPASS)
NetC37_1: C37.1 D3.1(A) R21.2
NetC37_2: C37.2 L7.2 X6.1(OSC1)
NetC38_1: C38.1 Q5.2(E) R19.1 R20.2
NetC39_1: C39.1 D4.1(A) R22.1
NetC39_2: C39.2 L7.1
NetC43_1: C43.1 U6.1(GAIN)
NetC43_2: C43.2 U6.8(GAIN)
NetC44_1: C44.1 C48.2 Q6.1(B) R25.1
NetC44_2: C44.2 C45.1 Q6.3(C) R24.1 R25.2
NetC46_1: C46.1 C47.2 L8.1 U6.6(VS)
NetC50_1: C50.1 Q7.3(C) R27.1 R28.2
NetC50_2: C50.2 D5.1(A) D6.2(K)
NetC51_2: C51.2 Q7.1(B) R28.1
NetC52_1: C52.1 D5.2(K) R29.1
NetCN3_1: CN3.1 CN4.3
NetPOT1_2: POT1.2(TAP) U6.2(-IN)
NetR29_2: R29.2 R30.1

Not connected (* = marked no-connect by the designer): U6 7(BYPASS)*

### Notes on the sheet
- Projeto:
- Tamanho:
- Data:
- A4
- Eng. Felipe Navarro
- Hora:
- Revisão:
- Folha
- de
- Arquivo:

### Library data of the parts
C19-C23 C28 C29 C31-C33 C38 C40-C42 C46 C48 C50 C51 = Cap 100nF 25V 0603 X7R: as C3 on sheet Mixer; Supplier 1: Digi-Key; Supplier Part Number 1: 490-1524-1-ND; ComponentLink1Description: Datasheet; ComponentLink1URL: D:\Tecnoclade\Datasheet\!DataMissing.pdf
C24 C25 = Cap 220pF 50V 0603 NP0: as C12 on sheet Mixer; Supplier 1: Digi-Key; Supplier Part Number 1: 1276-1048-1-ND; ComponentLink1Description: Datasheet; ComponentLink1URL: D:\Tecnoclade\Datasheet\!DataMissing.pdf
C30 = Cap 10uF 16V 0805 X6S LOESR: as C5 on sheet Mixer; Supplier 1: Digi-Key; Supplier Part Number 1: 445-7611-1-ND; ComponentLink1Description: Datasheet; ComponentLink1URL: D:\Tecnoclade\Datasheet\!DataMissing.pdf
C34 C44 = Cap 1nF 50V 0603 NP0: as C9 on sheet Mixer; Supplier 1: Digi-Key; Supplier Part Number 1: 490-1451-1-ND; ComponentLink1Description: Datasheet; ComponentLink1URL: D:\Tecnoclade\Datasheet\!DataMissing.pdf
C37 C39 = Trimmer 7-50pF 50V TZB4-BB: as C15 on sheet Mixer; Supplier 1: Digi-Key; Supplier Part Number 1: 490-1983-1-ND; Obs:: *; ComponentLink1Description: Datasheet; ComponentLink1URL: D:\Tecnoclade\Datasheet\!DataMissing.pdf
C43 C45 C47 = Cap 10uF 25V 0805 X5R: Capacitor (Semiconductor SIM Model); Chinês: Local; ChinesePrice: 0,02620; Corrente: *A; Potência: *W; Obs:: X5R; Tolerância: ±10%; Supplier 1: Digi-Key; Supplier Part Number 1: 587-2985-1-ND; ComponentLink1Description: Datasheet; ComponentLink1URL: D:\Tecnoclade\Datasheet\!DataMissing.pdf
C49 = Cap 4.7nF 50V 0603 X7R: Capacitor (Semiconductor SIM Model); Chinês: -----; ChinesePrice: 0,00000; Corrente: *A; Potência: *W; Obs:: X7R; Tolerância: ±10%; Supplier 1: Digi-Key; Supplier Part Number 1: 490-1506-1-ND; ComponentLink1Description: Datasheet; ComponentLink1URL: D:\Tecnoclade\Datasheet\!DataMissing.pdf
C52 = PCap 47uF 35V 5d.x11h.: Polarized Capacitor (Radial); ChinesePrice: 0,00000; Chinês: ----; Corrente: *A; Potência: *W; Obs: Alumínio (Z=0R22); Tolerância: ±20%; Supplier 1: Digi-Key; Supplier Part Number 1: 1189-1302-ND; ComponentLink1Description: Datasheet; ComponentLink1URL: D:\Tecnoclade\Datasheet\!DataMissing.pdf
CN1 = Jack-4Pol: Jack Socket, SMD Vertical, 4-Conductor Open Circuit; ChinesePrice: 0,00000; Chinês: ----; Corrente: 300mA; Tensão: 16V; Supplier 1: Digi-Key; Potência: *; Obs:: SJ1-42534-SMT; Tolerância: *; ComponentLink1Description: Datasheet; ComponentLink1URL: D:\Tecnoclade\Datasheet\Conector Jack SJ1-42534.pdf; Supplier Part Number 1: CP1-42534SJCT-ND
CN3 = KK 2P Macho-V P2.54mm: ChinesePrice: 0,01400; Chinês: Local; Corrente: *; Potência: *; Supplier 1: Digi-Key; Supplier Part Number 1: A19423-ND; Tensão: *; Obs:: *; Tolerância: *; ComponentLink1Description: Datasheet; ComponentLink1URL: D:\Tecnoclade\Datasheet\!DataMissing.pdf
CN4 = MJ-2523-SMT-TR: CONN AUDIO JACK MONO 2.5MM SMD; ChinesePrice: 0,00000; Chinês: ----; Corrente: 300mA; Obs:: SJ1-42534-SMT; Supplier 1: Digi-Key; Potência: *; Tolerância: *; ComponentLink1Description: Datasheet; ComponentLink1URL: D:\Tecnoclade\Datasheet\Conector Jack SJ1-42534.pdf; Supplier Part Number 1: CP-2523MJCT-ND
CN5 = Header 3: Header, 3-Pin; ChinesePrice: 0,10000; Chinês: Proved - Local; Value: Barra de 40 pinos - ATENÇÃO; Corrente: *; Potência: *; Supplier 1: Digi-Key; Supplier Part Number 1: A26509-40-ND; Tensão: *; Obs:: *; Tolerância: *; ComponentLink1Description: Datasheet; ComponentLink1URL: D:\Tecnoclade\Datasheet\!DataMissing.pdf
D3 D4 = PIN BAP64: as D1 on sheet BPF; Corrente: *; Potência: *; Supplier 1: Digi-Key; Supplier Part Number 1: 568-1929-1-ND; Tensão: *; Value: *; Obs:: *; Tolerância: *; ComponentLink1Description: Datasheet; ComponentLink1URL: D:\Tecnoclade\Datasheet\!DataMissing.pdf
D5 D6 = DP 75V 150mA SOD-323: Small Signal Diodes; ChinesePrice: 0,00000; Chinês: ----; Obs:: Small Signal =< 200mA (Io), Any Speed; Supplier 1: Digi-Key; Supplier Part Number 1: 1N4148WSFSCT-ND; Potência: *; Value: *; Tolerância: *; ComponentLink1Description: Datasheet; ComponentLink1URL: D:\Tecnoclade\Datasheet\!DataMissing.pdf
L4 L5 = Bd 1K@100MHz 0603 400mA: as L1 on sheet Mixer; Potência: *; Supplier 1: Digi-Key; Supplier Part Number 1: 445-1550-1-ND; Tensão: *; ComponentLink1Description: Datasheet; ComponentLink1URL: D:\Tecnoclade\Datasheet\!DataMissing.pdf; Substituição: 27/06/2014
L7 = Ind 10uH 0805 150mA: as L3 on sheet Mixer; Potência: *; Supplier 1: Digi-Key; Supplier Part Number 1: 587-2045-1-ND; Tensão: *; Obs:: *; ComponentLink1Description: Datasheet; ComponentLink1URL: D:\Tecnoclade\Datasheet\!DataMissing.pdf; Substituição: 00/00/0000
L8 = Bd 60R@100MHz 0603 500mA: ChinesePrice: 0,00820; Chinês: Local; Obs:: Ferrite (0R1); Tolerância: ±*%; Potência: *; Supplier 1: Digi-Key; Supplier Part Number 1: 490-1036-1-ND; Tensão: *; Substituição: 22/05/2014; ComponentLink1Description: Datasheet; ComponentLink1URL: D:\Tecnoclade\Datasheet\!DataMissing.pdf
POT1 = POT 100k Audio: Potenciometro; ChinesePrice: 0,00000; Chinês: ----; Corrente: *A; Potência: *W; Tensão: *V; Tolerância: ±*%; Supplier 1: Digi-Key; Supplier Part Number 1: PTV09A-2020F-B104-ND; Obs: *; ComponentLink1Description: Datasheet; ComponentLink1URL: D:\Tecnoclade\Datasheet\!DataMissing.pdf
Q2 Q6 = TRS MMBT3904 40V 200mA SOT-23-3N: NPN General Purpose Amplifier; Tensão: 40V; Corrente: 600mA; Potência: 350mW; Chinês: ----; ChinesePrice: 0,00000; Value: 300MHz; Supplier 1: Digi-Key; Supplier Part Number 1: 568-4510-1-ND; Obs:: *; Tolerância: *; ComponentLink1Description: Datasheet; ComponentLink1URL: D:\Tecnoclade\Datasheet\!DataMissing.pdf
Q5 = TRS 2SC3324 120V 100mA SOT-23-3: as Q3 on sheet Mixer; Supplier 1: Digi-Key; Supplier Part Number 1: 2SC3324-BL(TE85LFCT-ND; Obs:: *; Tolerância: *; ComponentLink1Description: Datasheet; ComponentLink1URL: D:\Tecnoclade\Datasheet\!DataMissing.pdf
Q7 = TRS MMBT2222 40V 200mA SOT-23-3N: as Q1 on sheet Mixer; Supplier 1: Digi-Key; Supplier Part Number 1: MMBT2222ATPMSCT-ND; Obs:: *; Tolerância: *; ComponentLink1Description: Datasheet; ComponentLink1URL: D:\Tecnoclade\Datasheet\!DataMissing.pdf
R6 R24 R27 = Res 4K7 1% 0603 1/10W: ChinesePrice: 0,00000; Chinês: ----; Corrente: *A; Potência: 1/10W; Tensão: *V; Obs: ±100ppm/ºC; Tolerância: ±1%; Supplier 1: Digi-Key; Supplier Part Number 1: RMCF0603FT4K70CT-ND; ComponentLink1Description: Datasheet; ComponentLink1URL: D:\Tecnoclade\Datasheet\!DataMissing.pdf
R7 = Res 10K 1% 0603 1/10W: ChinesePrice: 0,00089; Chinês: Local; Corrente: *A; Potência: 1/10W; Tensão: *V; Tolerância: ±1%; Supplier 1: Digi-Key; Supplier Part Number 1: P10.0KHCT-ND; Obs: *; ComponentLink1Description: Datasheet; ComponentLink1URL: D:\Tecnoclade\Datasheet\!DataMissing.pdf
R8 R25 R28 R29 = Res 100K 1% 0603 1/10W: ChinesePrice: 0,00089; Chinês: Local; Corrente: *A; Potência: 1/10W; Tensão: *V; Tolerância: ±1%; Supplier 1: Digi-Key; Supplier Part Number 1: P100KHCT-ND; Obs: *; ComponentLink1Description: Datasheet; ComponentLink1URL: D:\Tecnoclade\Datasheet\!DataMissing.pdf
R9 = Res Trim: Trimmer; ChinesePrice: 0,00000; Chinês: ----; Corrente: *A; Potência: *W; Tensão: *V; Tolerância: ±*%; Supplier 1: Digi-Key; Supplier Part Number 1: 490-2876-ND; Obs: *; ComponentLink1Description: Datasheet; ComponentLink1URL: D:\Tecnoclade\Datasheet\!DataMissing.pdf
R19 = Res 2K2 5% 0603 1/10W: as R13 on sheet Mixer; Supplier 1: Digi-Key; Supplier Part Number 1: RMCF0603JT2K20CT-ND; ComponentLink1Description: Datasheet; ComponentLink1URL: D:\Tecnoclade\Datasheet\!DataMissing.pdf
R20 = Res 560R 1% 0603 1/10w: as R14 on sheet Mixer; Supplier 1: Digi-Key; Supplier Part Number 1: 311-560HRCT-ND; Obs:: *; ComponentLink1Description: Datasheet; ComponentLink1URL: D:\Tecnoclade\Datasheet\!DataMissing.pdf
R21 R22 = Res 1K 1% 0603 1/10W: as R5 on sheet Mixer; Supplier 1: Digi-Key; Supplier Part Number 1: RMCF0603FT1K00CT-ND; Obs: *; ComponentLink1Description: Datasheet; ComponentLink1URL: D:\Tecnoclade\Datasheet\!DataMissing.pdf
R23 R26 R30 = Res Pot: as R12 on sheet Mixer; Supplier 1: Digi-Key; Supplier Part Number 1: --Del; Obs: *; ComponentLink1Description: Datasheet; ComponentLink1URL: D:\Tecnoclade\Datasheet\!DataMissing.pdf
U4 = MC78L05: as U1 on sheet Mixer; Potência: *; Value: *; Supplier 1: Digi-Key; Supplier Part Number 1: MC78L05ACHXCT-ND; Tensão: 5V; Obs:: *; Tolerância: *; ComponentLink1Description: Datasheet; ComponentLink1URL: D:\Tecnoclade\Datasheet\
U5 = TA7358: as U2 on sheet Mixer; Corrente: *; Potência: *; Tensão: *; Value: *; Supplier 1: Digi-Key; Obs:: *; Tolerância: *; ComponentLink1Description: Datasheet; ComponentLink1URL: D:\Tecnoclade\Datasheet\
U6 = LM386: IC AMP AUDIO PWR .325W AB 8SOIC; ChinesePrice: 1,94000; Chinês: Local; Value: Memória; Corrente: *; Potência: *; Supplier 1: Digi-Key; Supplier Part Number 1: LM386MX-1/NOPBCT-ND; Tensão: *; Obs:: *; Tolerância: *; ComponentLink1Description: Datasheet; ComponentLink1URL: D:\Tecnoclade\Datasheet\!DataMissing.pdf
X6 = XTAL: as X1 on sheet Mixer; Corrente: *; Potência: *; Supplier 1: Digi-Key; Supplier Part Number 1: --Del; Tensão: *; Obs:: *; Tolerância: *

## Sheet RX_Pre.SchDoc: Ararinha 6F
size A4; Revision: 1.0; SheetNumber: 4; SheetTotal: 7
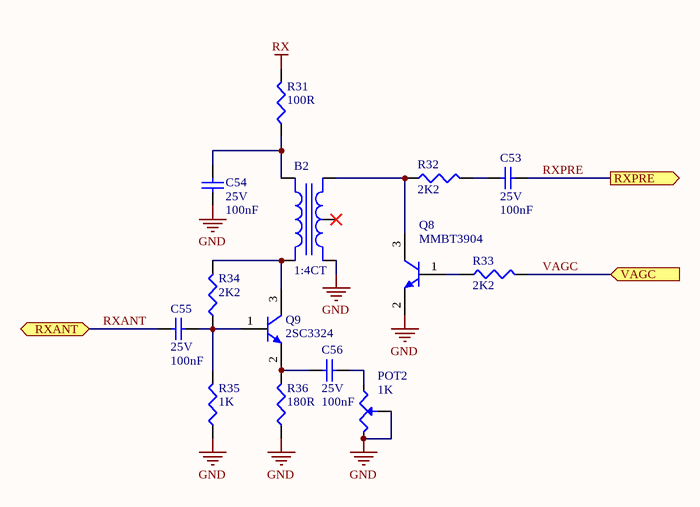
[diagram p5: RX_Pre.SchDoc]

### Parts
B2  1:4CT  [CX2047LANL]
C53  value 100nF  Tensão: 25V  [CC0603]  (hidden comment: Capacitor Cerâmico)
C54  value 100nF  Tensão: 25V  [CC0603]  (hidden comment: Capacitor Cerâmico)
C55  value 100nF  Tensão: 25V  [CC0603]  (hidden comment: Capacitor Cerâmico)
C56  value 100nF  Tensão: 25V  [CC0603]  (hidden comment: Capacitor Cerâmico)
POT2  value 1K  [POT - PTV09]  (hidden comment: Potenciômetro)
Q8  MMBT3904  [SOT-23-3N]
Q9  2SC3324  [SOT-23-3N]
R31  value 100R  [CC0603]  (hidden comment: Resistor)
R32  value 2K2  [CC0603]  (hidden comment: Resistor)
R33  value 2K2  [CC0603]  (hidden comment: Resistor)
R34  value 2K2  [CC0603]  (hidden comment: Resistor)
R35  value 1K  [CC0603]  (hidden comment: Resistor)
R36  value 180R  [CC0603]  (hidden comment: Resistor)

### Ports
RXANT (bidir), RXPRE (out), VAGC (in)

### Nets
GND: B2.3(Pri-) C54.1 POT2.2(TAP) POT2.3 Q8.2(E) R35.1 R36.1
RX: R31.2
RXANT: C55.2 ; port RXANT
RXPRE: C53.1 ; port RXPRE  [project net BPFB]
VAGC: R33.2 ; port VAGC
NetB2_1: B2.1(Sec+) Q8.3(C) R32.1
NetB2_4: B2.4(Pri+) Q9.3(C) R34.2
NetB2_6: B2.6(Sec-) C54.2 R31.1
NetC53_2: C53.2 R32.2
NetC55_1: C55.1 Q9.1(B) R34.1 R35.2
NetC56_1: C56.1 POT2.1
NetC56_2: C56.2 Q9.2(E) R36.2
NetQ8_1: Q8.1(B) R33.1

Not connected (* = marked no-connect by the designer): B2 2(Sec+)*

### Notes on the sheet
- Projeto:
- Tamanho:
- Data:
- A4
- Eng. Felipe Navarro
- Hora:
- Revisão:
- Folha
- de
- Arquivo:

### Library data of the parts
B2 = BALUN CX2047LANL: as B1 on sheet Mixer; Corrente: *; Potência: *; Supplier 1: Digi-Key; Supplier Part Number 1: 553-2770-1-ND; Tensão: *; Obs:: *; Tolerância: *; ComponentLink1Description: Datasheet; ComponentLink1URL: D:\Tecnoclade\Datasheet\!DataMissing.pdf; Substituição: 00/00/0000; Value: *
C53-C56 = Cap 100nF 25V 0603 X7R: as C3 on sheet Mixer; Supplier 1: Digi-Key; Supplier Part Number 1: 490-1524-1-ND; ComponentLink1Description: Datasheet; ComponentLink1URL: D:\Tecnoclade\Datasheet\!DataMissing.pdf
POT2 = POT 100k Audio: as POT1 on sheet IF; Supplier 1: Digi-Key; Supplier Part Number 1: PTV09A-2020F-B102-ND; Obs: *; ComponentLink1Description: Datasheet; ComponentLink1URL: D:\Tecnoclade\Datasheet\!DataMissing.pdf
Q8 = TRS MMBT3904 40V 200mA SOT-23-3N: as Q2 on sheet IF; Supplier 1: Digi-Key; Supplier Part Number 1: 568-4510-1-ND; Obs:: *; Tolerância: *; ComponentLink1Description: Datasheet; ComponentLink1URL: D:\Tecnoclade\Datasheet\!DataMissing.pdf
Q9 = TRS 2SC3324 120V 100mA SOT-23-3: as Q3 on sheet Mixer; Supplier 1: Digi-Key; Supplier Part Number 1: 2SC3324-BL(TE85LFCT-ND; Obs:: *; Tolerância: *; ComponentLink1Description: Datasheet; ComponentLink1URL: D:\Tecnoclade\Datasheet\!DataMissing.pdf
R31 = Res 100R 5% 0603 1/10W: as R3 on sheet BPF; Supplier 1: Digi-Key; Supplier Part Number 1: RMCF0603JT100RCT-ND; Obs: *; ComponentLink1Description: Datasheet; ComponentLink1URL: D:\Tecnoclade\Datasheet\!DataMissing.pdf
R32-R34 = Res 2K2 5% 0603 1/10W: as R13 on sheet Mixer; Supplier 1: Digi-Key; Supplier Part Number 1: RMCF0603JT2K20CT-ND; ComponentLink1Description: Datasheet; ComponentLink1URL: D:\Tecnoclade\Datasheet\!DataMissing.pdf
R35 = Res 1K 1% 0603 1/10W: as R5 on sheet Mixer; Supplier 1: Digi-Key; Supplier Part Number 1: RMCF0603FT1K00CT-ND; Obs: *; ComponentLink1Description: Datasheet; ComponentLink1URL: D:\Tecnoclade\Datasheet\!DataMissing.pdf
R36 = Res 180R 1% 0603 1/10W: as R16 on sheet Mixer; Supplier 1: Digi-Key; Supplier Part Number 1: RMCF0603FT180RCT-ND; ComponentLink1Description: Datasheet; ComponentLink1URL: D:\Tecnoclade\Datasheet\!DataMissing.pdf

## Sheet Fonte.SchDoc: Ararinha 6F
size A4; Revision: 1.0; SheetNumber: 7; SheetTotal: 7
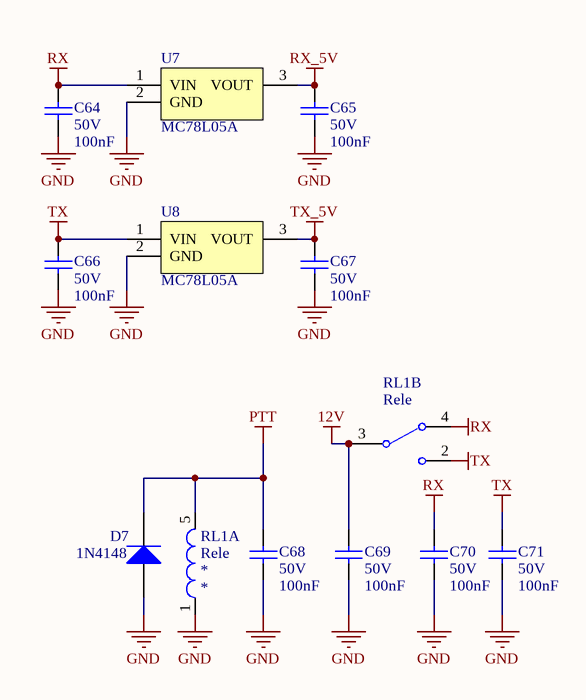
[diagram p6: Fonte.SchDoc]

### Parts
C64  value 100nF  Tensão: 50V  [CC0603]  (hidden comment: Capacitor Cerâmico)
C65  value 100nF  Tensão: 50V  [CC0603]  (hidden comment: Capacitor Cerâmico)
C66  value 100nF  Tensão: 50V  [CC0603]  (hidden comment: Capacitor Cerâmico)
C67  value 100nF  Tensão: 50V  [CC0603]  (hidden comment: Capacitor Cerâmico)
C68  value 100nF  Tensão: 50V  [CC0603]  (hidden comment: Capacitor Cerâmico)
C69  value 100nF  Tensão: 50V  [CC0603]  (hidden comment: Capacitor Cerâmico)
C70  value 100nF  Tensão: 50V  [CC0603]  (hidden comment: Capacitor Cerâmico)
C71  value 100nF  Tensão: 50V  [CC0603]  (hidden comment: Capacitor Cerâmico)
D7  1N4148  [SOD-323 Diodo-K2]
RL1  Rele  [Rele SPDT]  (parts A,B of 2)
U7  MC78L05A  [SOT-89-3N]
U8  MC78L05A  [SOT-89-3N]

### Nets
12V: C69.2 RL1.3(C)
GND: C64.1 C65.1 C66.1 C67.1 C68.1 C69.1 C70.1 C71.1 D7.1(A) RL1.1(L1) U7.2(GND) U8.2(GND)
PTT: C68.2 D7.2(K) RL1.5(L2)
RX: C64.2 C70.2 RL1.4(NF) U7.1(VIN)
RX_5V: C65.2 U7.3(VOUT)
TX: C66.2 C71.2 RL1.2(NA) U8.1(VIN)
TX_5V: C67.2 U8.3(VOUT)

### Notes on the sheet
- Projeto:
- Tamanho:
- Data:
- A4
- Eng. Felipe Navarro
- Hora:
- Revisão:
- Folha
- de
- Arquivo:

### Library data of the parts
C64-C71 = Cap 100nF 50V 0603 X7R: as C57 on sheet Block; Supplier 1: Digi-Key; Supplier Part Number 1: 1276-1000-1-ND; ComponentLink1Description: Datasheet; ComponentLink1URL: D:\Tecnoclade\Datasheet\!DataMissing.pdf
D7 = DP 75V 150mA SOD-323: as D5 on sheet IF; Supplier 1: Digi-Key; Supplier Part Number 1: 1N4148WSFSCT-ND; Potência: *; Value: *; Tolerância: *; ComponentLink1Description: Datasheet; ComponentLink1URL: D:\Tecnoclade\Datasheet\!DataMissing.pdf
RL1 = Rele SPDT: Rele de uma chave e dois contatos; ChinesePrice: 0,00000; Chinês: ----; Potência: *; Supplier 1: Digi-Key; Supplier Part Number 1: --Del; Value: *; Obs:: *; Tolerância: *; ComponentLink1Description: Datasheet; ComponentLink1URL: D:\Tecnoclade\Datasheet\; Corrente: *; Tensão: *
U7 U8 = MC78L05: as U1 on sheet Mixer; Potência: *; Value: *; Supplier 1: Digi-Key; Supplier Part Number 1: MC78L05ACHXCT-ND; Tensão: 5V; Obs:: *; Tolerância: *; ComponentLink1Description: Datasheet; ComponentLink1URL: D:\Tecnoclade\Datasheet\

## Nets that join several sheets
12V: Block (CN6.1 CN9.1), Mixer (5 pins), IF (C28.1 CN1.4 L5.1), Fonte (C69.2 RL1.3)
GND: Block (22 pins), Mixer (24 pins), BPF1 (BL1.1.1 C1.1.1 C2.1.1), BPF2 (BL1.2.1 C1.2.1 C2.2.1), BPF3 (BL1.3.1 C1.3.1 C2.3.1), XtalFilter (BL2.1 C17.1 C18.1), IF (32 pins), RX_Pre (7 pins), Fonte (12 pins)
PTT: IF (CN1.3), Fonte (C68.2 D7.2 RL1.5)
RX: Block (CN9.3), IF (L8.2 R24.2 R27.2), RX_Pre (R31.2), Fonte (C64.2 C70.2 RL1.4 U7.1)
RX_5V: Block (6 pins), Fonte (C65.2 U7.3)
TX: Block (CN9.2), IF (C20.1 L4.2), Fonte (C66.2 C71.2 RL1.2 U8.1)
TX_5V: Block (6 pins), Fonte (C67.2 U8.3)
BPFA: Block (C57.2), BPF1 (D1.1.2), BPF2 (D1.2.2), BPF3 (D1.3.2)
BPFB: Block (C72.2), BPF1 (D2.1.2), BPF2 (D2.2.2), BPF3 (D2.3.2), RX_Pre (C53.1)
CNTR: Block (CN6.2 CN9.4), BPF3 (R3.3.2)
CNTR: Block (CN6.3 CN9.5), BPF2 (R3.2.2)
CNTR: Block (CN6.4 CN9.6), BPF1 (R3.1.2)
IFIN: Block (U9.3), IF (C31.1)
IFOUT: Block (U9.1), IF (C38.2)
MIXERIN: Block (U10.3 U11.3), Mixer (C6.2)
MIXEROUT: Block (U10.1 U11.1), Mixer (R11.2)
RXANT: Block (CN7.1), RX_Pre (C55.2)
VAGC: IF (R30.2), RX_Pre (R33.2)
XTALA: Block (U9.5), XtalFilter (X2.1)
XTALB: Block (U10.5), XtalFilter (X5.2)